# EasyEDA schematic Bike(Alpha).json

## Sheets
1 Sheet_1: TITLE: Sheet_1; REV: 1.0; Date: 2022-07-16; Sheet: 1/1; Drawn By: Artempro; Company: Your Company
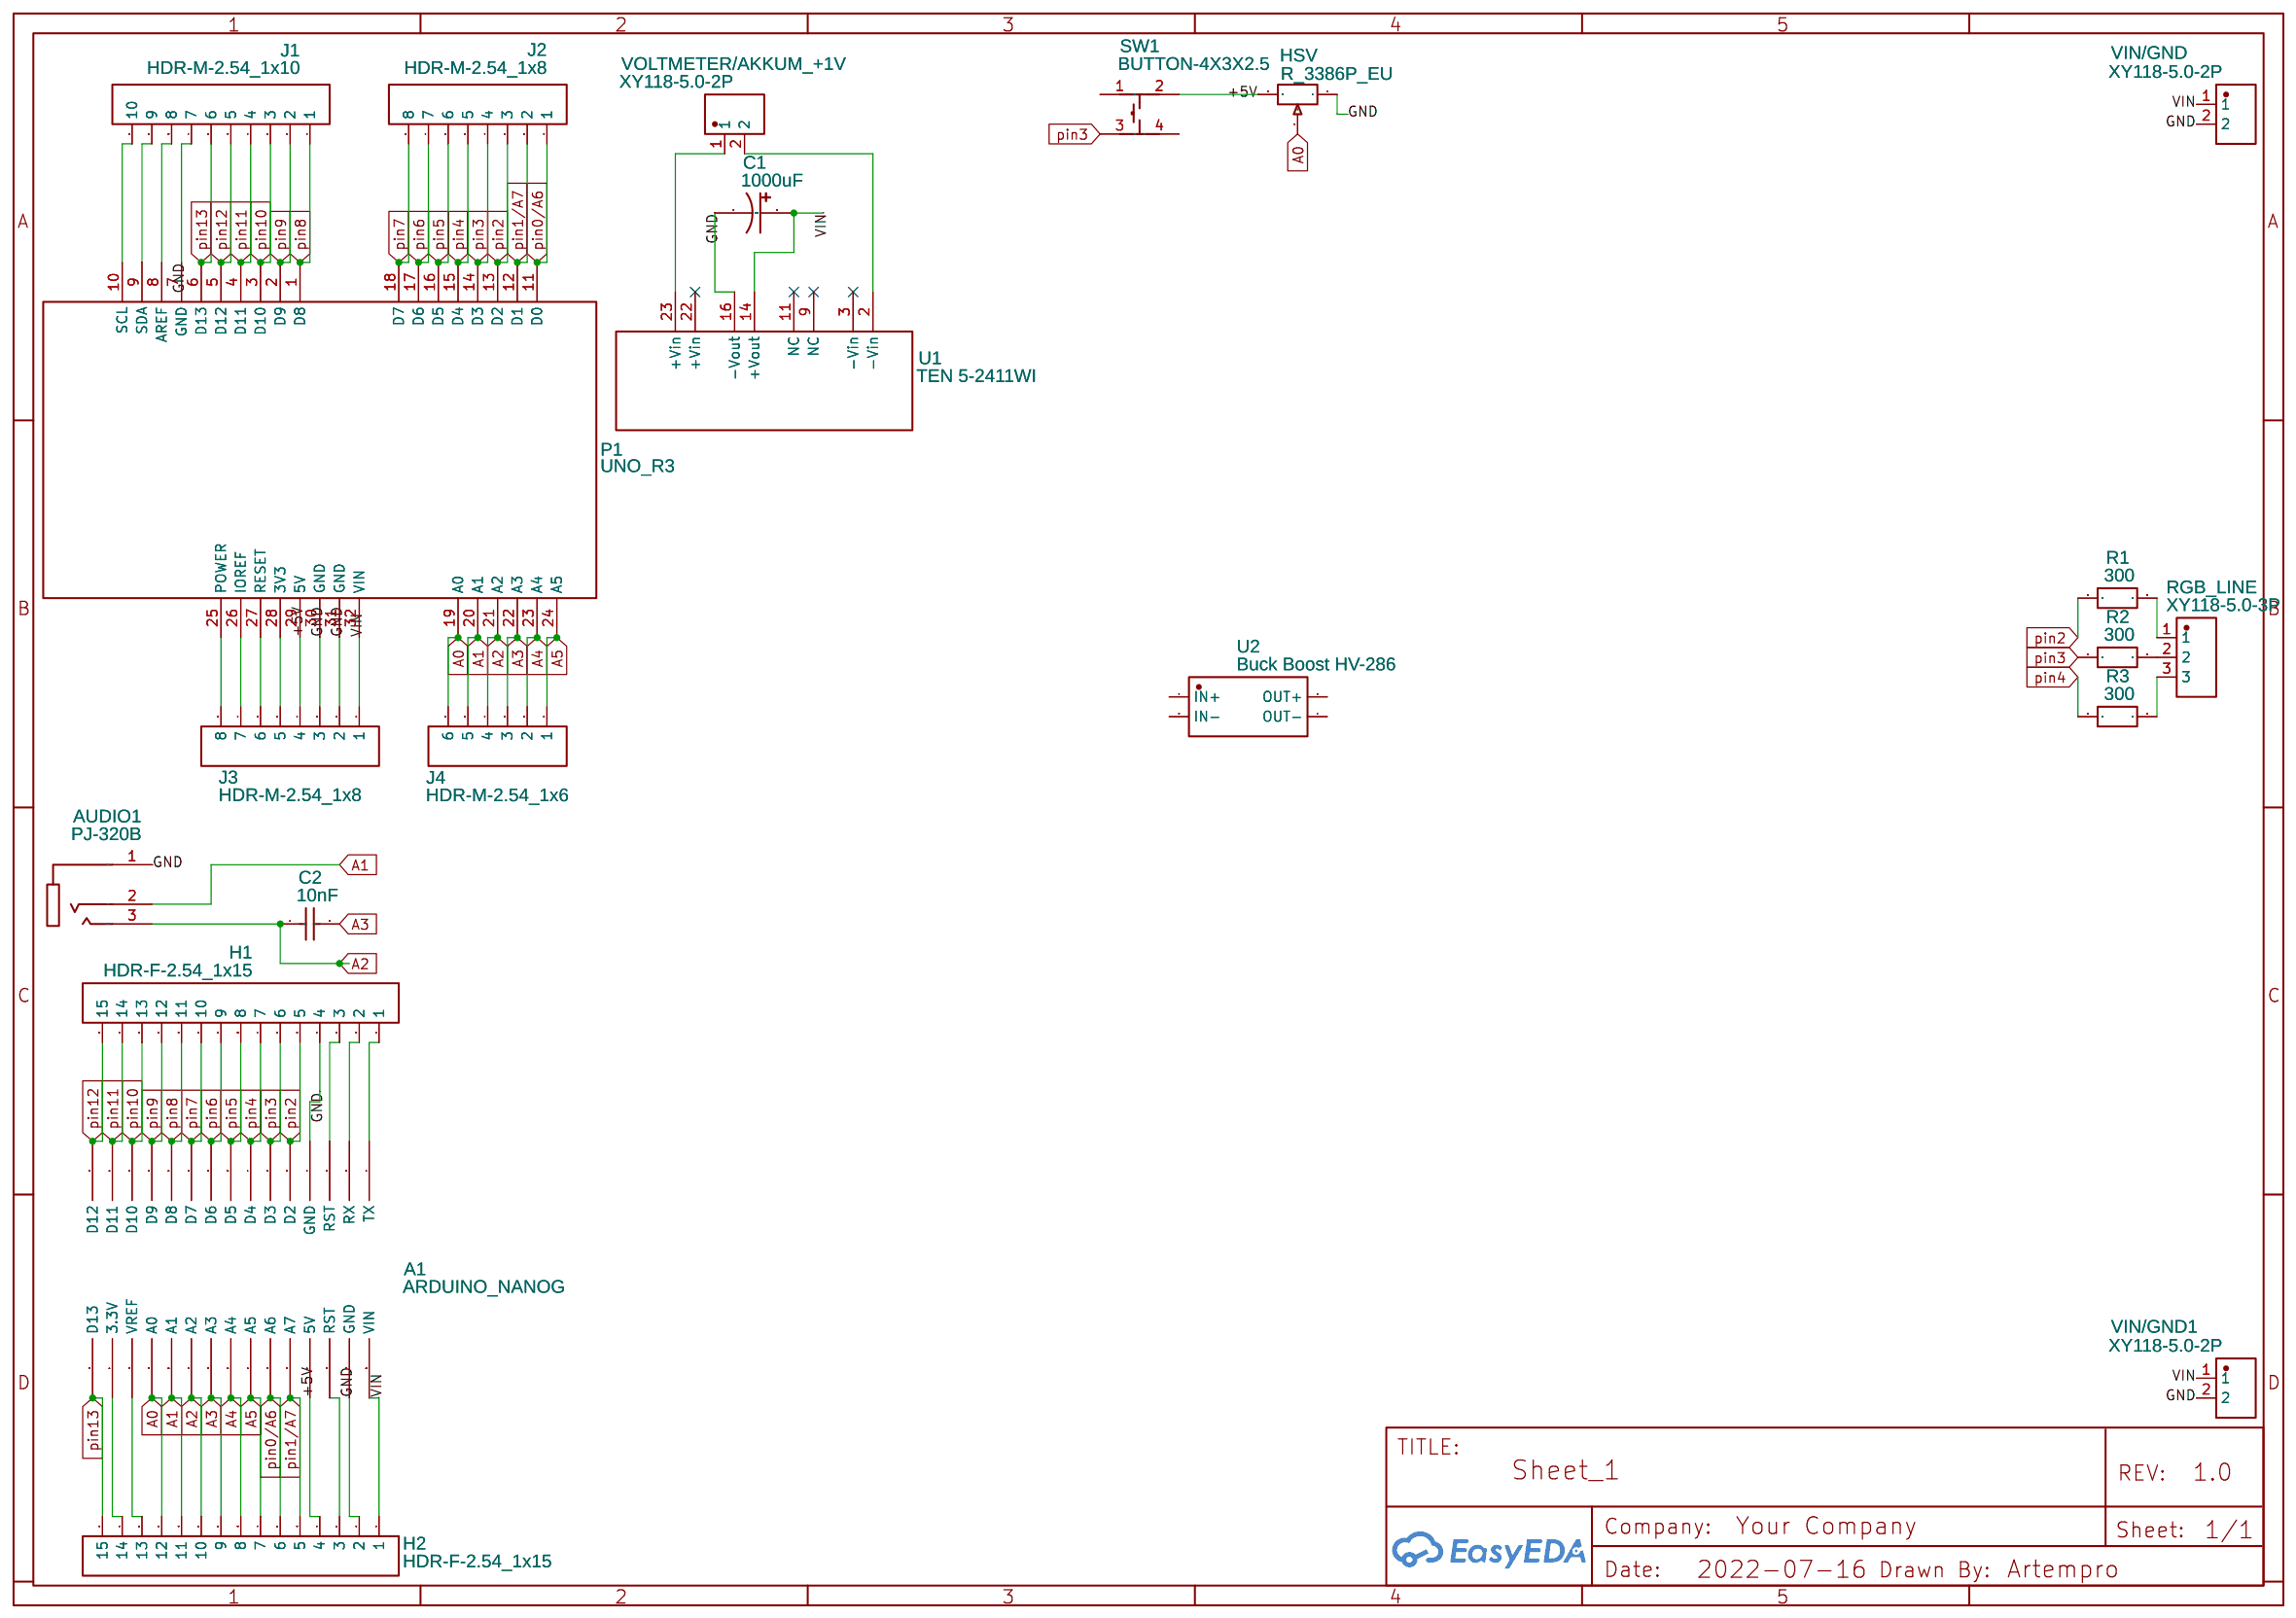
[diagram p0: Sheet_1]
2 Add multi media
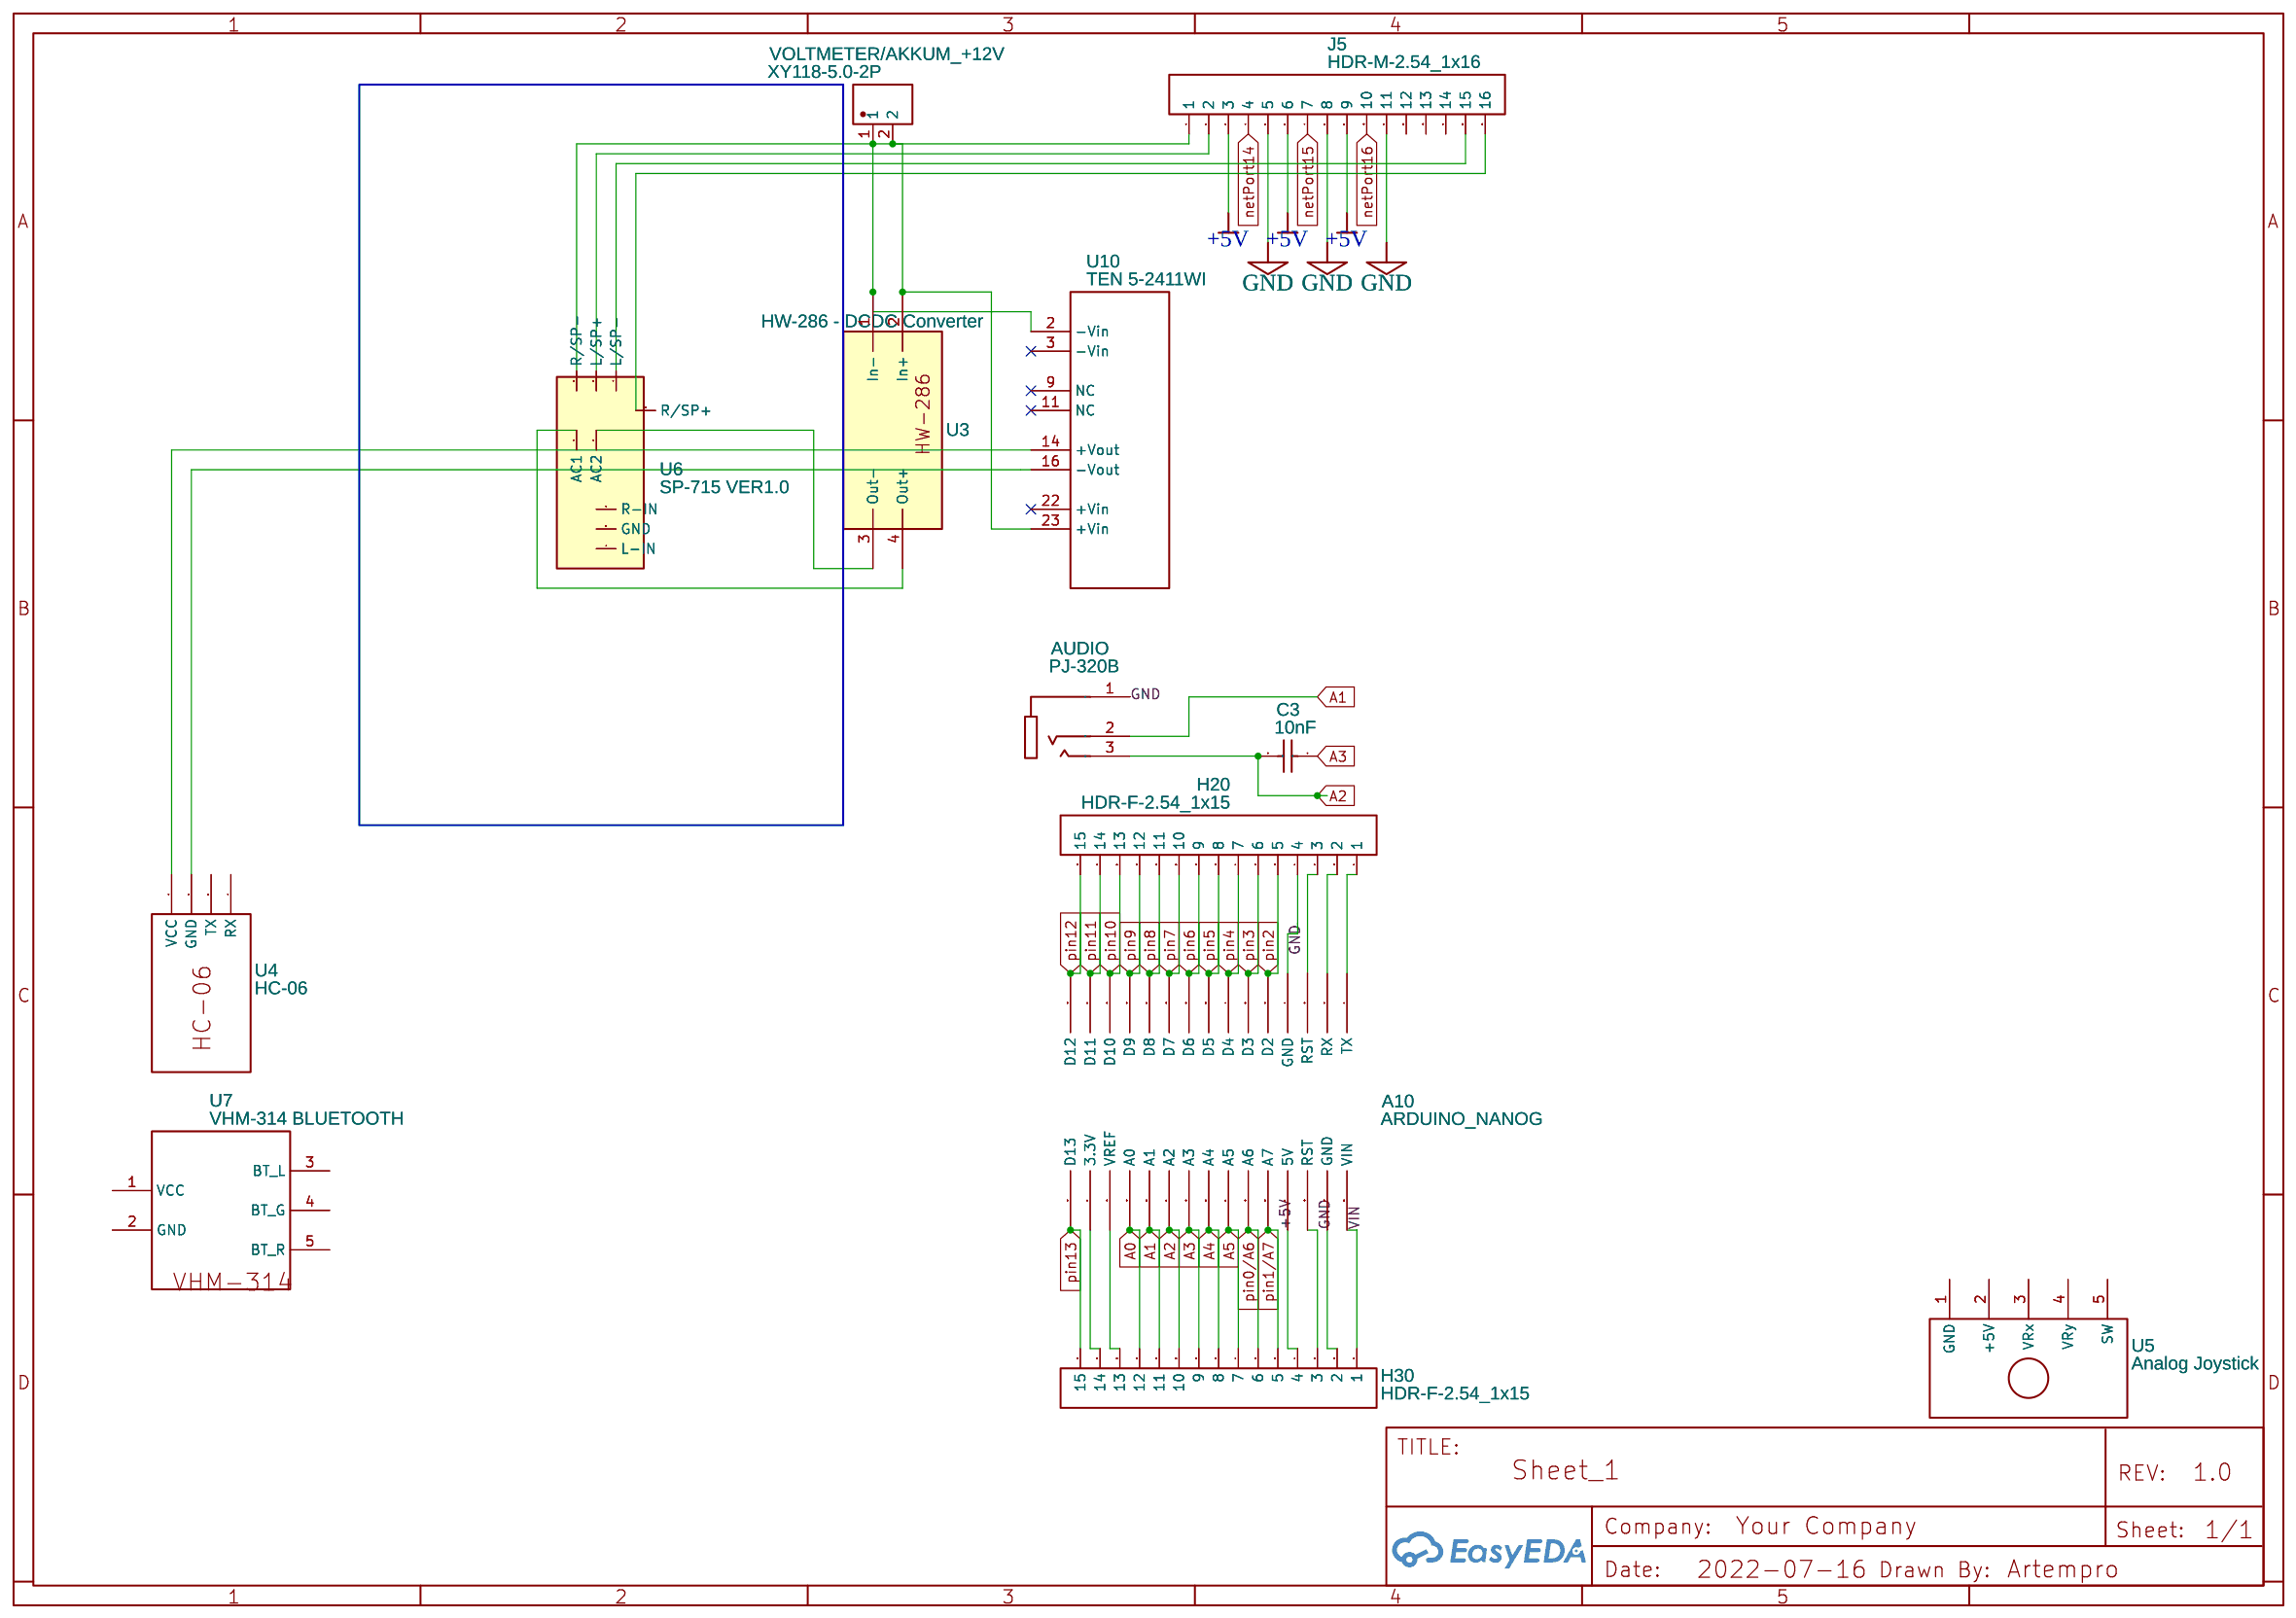
[diagram p1: Add multi media]

## Parts
sheet Add multi media
A10  ARDUINO_NANOG  [ARDUINO_NANO2]
AUDIO  PJ-320B  [AUDIO-SMD_PJ-320B]
C3  10nF  [CAP-TH_L14.0-W5.0-P7.50-1.2]
H20  HDR-F-2.54_1x15  [HDR-F-2.54_1X15]
H30  HDR-F-2.54_1x15  [HDR-F-2.54_1X15]
J5  HDR-M-2.54_1x16  [HDR-M-2.54_1X16]
U3  HW-286 - DCDC Converter  [HW-286 DCDC CONVERTER]
U4  HC-06  [BLUETOOTH HC-06]
U5  Analog Joystick  [ANALOG JOYSTICK]
U6  SP-715 VER1.0  [SP-715]
U7  VHM-314 BLUETOOTH  [VHM-314]
U10  TEN 5-2411WI  [TEN 5-2411WI]
VOLTMETER/AKKUM_+12V  XY118-5.0-2P  [CONN-TH_XY118-5.0-2P]
sheet Sheet_1
A1  ARDUINO_NANOG  [ARDUINO_NANO2]
AUDIO1  PJ-320B  [AUDIO-SMD_PJ-320B]
C1  1000uF  [CAP-TH_BD8.0-P3.50-D0.6-FD]
C2  10nF  [CAP-TH_L14.0-W5.0-P7.50-1.2]
H1  HDR-F-2.54_1x15  [HDR-F-2.54_1X15]
H2  HDR-F-2.54_1x15  [HDR-F-2.54_1X15]
HSV  R_3386P_EU  [RES-ADJ-TH_3386P]
J1  HDR-M-2.54_1x10  [HDR-M-2.54_1X10]
J2  HDR-M-2.54_1x8  [HDR-M-2.54_1X8]
J3  HDR-M-2.54_1x8  [HDR-M-2.54_1X8]
J4  HDR-M-2.54_1x6  [HDR-M-2.54_1X6]
P1  UNO_R3  [UNO_R3]
R1  300  [RES-TH_BD2.4-L6.3-P10.30-D0.6]
R2  300  [RES-TH_BD2.4-L6.3-P10.30-D0.6]
R3  300  [RES-TH_BD2.4-L6.3-P10.30-D0.6]
RGB_LINE  XY118-5.0-3P  [CONN-TH_XY118-5.0-3P]
SW1  BUTTON-4X3X2.5  [SW-SMD_4P-L4.2-W3.2-P2.15-LS5.2]
U1  TEN 5-2411WI  [TEN 5-2411WI]
U2  Buck Boost HV-286  [BUCK BOOST HW-286]
VIN/GND  XY118-5.0-2P  [CONN-TH_XY118-5.0-2P]
VIN/GND1  XY118-5.0-2P  [CONN-TH_XY118-5.0-2P]
VOLTMETER/AKKUM_+1V  XY118-5.0-2P  [CONN-TH_XY118-5.0-2P]

## Library data of the parts
A1 A10 = ARDUINO_NANOG: Manufacturer Part: Arduino Nano; Contributor: eyal89502
AUDIO AUDIO1 = PJ-320B: Supplier: LCSC; Manufacturer: BOOMELE; Contributor: LCSC; Supplier Part: C18594; JLCPCB Part Class: Extended Part
C2 C3 = DE2F3KY103MN3AM02F: Supplier: LCSC; Manufacturer: MuRata; Supplier Part: C85855; JLCPCB Part Class: Extended Part
H1 H2 H20 H30 = HDR-F-2.54_1x15: Supplier Part: C124408; Supplier: LCSC; Contributor: LCEDA_Lib
J5 = HDR-M-2.54_1x16: Supplier: LCSC; Contributor: LCEDA_Lib
U3 = HW-286 - DCDC Converter: Supplier: Aliexpress; Supplier Part: HW-286; Contributor: Guest
U4 = HC-06: Contributor: nico.hampl1999; sourceId: 31jdvN5mE
U5 = Analog Joystick: link: https://www.amazon.in/dp/B01HTH9ITK?msclkid=fe409e535b8011ed90db36c40a3051b8; Contributor: akshayrdhotre
U6 = SP-715 VER1.0: Manufacturer Part: SP-715 VER 1.0; Contributor: Artempro
U7 = VHM-314 BLUETOOTH: Contributor: Alexander_Semenov
U1 U10 = TEN 5-2411WI: Contributor: andrewys03
VIN/GND VIN/GND1 VOLTMETER/AKKUM_+1V VOLTMETER/AKKUM_+12V = XY118-5.0-2P: Supplier: LCSC; Supplier Part: C784922; Manufacturer: Ningbo Xinlaiya Elec.; Contributor: LCSC; JLCPCB Part Class: Extended Part
C1 = RGA102MOJBK-0811: Supplier: LCSC; Supplier Part: C311644; Manufacturer: Lelon; Contributor: LCSC
HSV = R_3386P_EU: Supplier: LCSC; Contributor: LCEDA_Lib; Value(Ω): 10K
J1 = HDR-M-2.54_1x10: Supplier Part: C57369; Supplier: LCSC; Contributor: LCEDA_Lib
J2 J3 = HDR-M-2.54_1x8: Supplier Part: C190820; Supplier: LCSC; Contributor: LCEDA_Lib
J4 = HDR-M-2.54_1x6: Supplier Part: C190819; Supplier: LCSC; Contributor: LCEDA_Lib
P1 = UNO_R3: sourceId: 1T5FDZYC8
R1-R3 = RD 1/4W 300R J T/B A1: Supplier: LCSC; Supplier Part: C433735; Manufacturer: TyoHM; Contributor: LCSC; JLCPCB Part Class: Extended Part; Resistance: 300Ω
RGB_LINE = XY118-5.0-3P: Supplier: LCSC; Supplier Part: C784923; Manufacturer: Ningbo Xinlaiya Elec.; Contributor: LCSC; JLCPCB Part Class: Extended Part
SW1 = BUTTON-4X3X2.5: Supplier: LCSC; Supplier Part: C9900020294; Manufacturer: null; JLCPCB Part Class: Extended Part; Contributor: lcsc
U2 = Buck Boost HV-286: Contributor: Stefano Rossi

## Nets
+5V: A1.27(5V) A10.27(5V) H2.4 H30.4 HSV.3 J3.4 J5.3 J5.6 J5.9 P1.29(5V) SW1.2
GND: A1.4(GND) A1.29(GND) A10.4(GND) A10.29(GND) AUDIO.1 AUDIO1.1 C1.2 H1.4 H2.2 H20.4 H30.2 HSV.1 J1.7 J3.2 J3.3 J5.5 J5.8 J5.11 P1.7(GND) P1.30(GND) P1.31(GND) U1.16(-Vout) VIN/GND.2 VIN/GND1.2
VIN: A1.30(VIN) A10.30(VIN) C1.1 H2.1 H30.1 J3.1 P1.32(VIN) U1.14(+Vout) VIN/GND.1 VIN/GND1.1
A0: A1.19(A0) A10.19(A0) H2.12 H30.12 HSV.2 J4.6 P1.19(A0)
A1: A1.20(A1) A10.20(A1) AUDIO.2 AUDIO1.2 H2.11 H30.11 J4.5 P1.20(A1)
A2: A1.21(A2) A10.21(A2) AUDIO.3 AUDIO1.3 C2.2 C3.2 H2.10 H30.10 J4.4 P1.21(A2)
A3: A1.22(A3) A10.22(A3) C2.1 C3.1 H2.9 H30.9 J4.3 P1.22(A3)
A4: A1.23(A4) A10.23(A4) H2.8 H30.8 J4.2 P1.23(A4)
A5: A1.24(A5) A10.24(A5) H2.7 H30.7 J4.1 P1.24(A5)
netPort14: J5.4
netPort15: J5.7
netPort16: J5.10
pin0/A6: A1.25(A6) A10.25(A6) H2.6 H30.6 J2.1 P1.11(D0)
pin1/A7: A1.26(A7) A10.26(A7) H2.5 H30.5 J2.2 P1.12(D1)
pin2: A1.5(D2) A10.5(D2) H1.5 H20.5 J2.3 P1.13(D2) R1.1
pin3: A1.6(D3) A10.6(D3) H1.6 H20.6 J2.4 P1.14(D3) R2.1 SW1.3
pin4: A1.7(D4) A10.7(D4) H1.7 H20.7 J2.5 P1.15(D4) R3.1
pin5: A1.8(D5) A10.8(D5) H1.8 H20.8 J2.6 P1.16(D5)
pin6: A1.9(D6) A10.9(D6) H1.9 H20.9 J2.7 P1.17(D6)
pin7: A1.10(D7) A10.10(D7) H1.10 H20.10 J2.8 P1.18(D7)
pin8: A1.11(D8) A10.11(D8) H1.11 H20.11 J1.1 P1.1(D8)
pin9: A1.12(D9) A10.12(D9) H1.12 H20.12 J1.2 P1.2(D9)
pin10: A1.13(D10) A10.13(D10) H1.13 H20.13 J1.3 P1.3(D10)
pin11: A1.14(D11) A10.14(D11) H1.14 H20.14 J1.4 P1.4(D11)
pin12: A1.15(D12) A10.15(D12) H1.15 H20.15 J1.5 P1.5(D12)
pin13: A1.16(D13) A10.16(D13) H2.15 H30.15 J1.6 P1.6(D13)
Net-(A1-1): A1.1(TX) H1.1
Net-(A1-2): A1.2(RX) H1.2
Net-(A1-3): A1.3(RST) H1.3
Net-(A1-17): A1.17(3.3V) H2.14
Net-(A1-18): A1.18(VREF) H2.13
Net-(A1-28): A1.28(RST) H2.3
Net-(A10-1): A10.1(TX) H20.1
Net-(A10-2): A10.2(RX) H20.2
Net-(A10-3): A10.3(RST) H20.3
Net-(A10-17): A10.17(3.3V) H30.14
Net-(A10-18): A10.18(VREF) H30.13
Net-(A10-28): A10.28(RST) H30.3
Net-(J1-8): J1.8 P1.8(AREF)
Net-(J1-9): J1.9 P1.9(SDA)
Net-(J1-10): J1.10 P1.10(SCL)
Net-(J3-5): J3.5 P1.28(3V3)
Net-(J3-6): J3.6 P1.27(RESET)
Net-(J3-7): J3.7 P1.26(IOREF)
Net-(J3-8): J3.8 P1.25(POWER)
Net-(J5-1): J5.1 U3.1(In-) U3.2(In+) U6.3(R/SP-) U10.2(-Vin) U10.23(+Vin) VOLTMETER/AKKUM_+12V.1 VOLTMETER/AKKUM_+12V.2
Net-(J5-2): J5.2 U6.5(L/SP+)
Net-(J5-15): J5.15 U6.4(L/SP-)
Net-(J5-16): J5.16 U6.6(R/SP+)
Net-(R1-2): R1.2 RGB_LINE.1
Net-(R2-2): R2.2 RGB_LINE.2
Net-(R3-2): R3.2 RGB_LINE.3
Net-(U1-2): U1.2(-Vin) VOLTMETER/AKKUM_+1V.2
Net-(U1-23): U1.23(+Vin) VOLTMETER/AKKUM_+1V.1
Net-(U3-3): U3.3(Out-) U6.2(AC2)
Net-(U3-4): U3.4(Out+) U6.1(AC1)
Net-(U4-1): U4.1(VCC) U10.14(+Vout)
Net-(U4-2): U4.2(GND) U10.16(-Vout)

Not connected (* = marked no-connect by the designer): J5 12 13 14; SW1 1 4; U1 3(-Vin)* 9(NC)* 11(NC)* 22(+Vin)*; U2 1(IN+) 2(IN-) 3(OUT+) 4(OUT-); U4 3(TX) 4(RX); U5 1(GND) 2(+5V) 3(VRx) 4(VRy) 5(SW); U6 7(L-IN) 8(GND) 9(R-IN); U7 1(VCC) 2(GND) 3(BT_L) 4(BT_G) 5(BT_R); U10 3(-Vin)* 9(NC)* 11(NC)* 22(+Vin)*
